# Altium project RamanPrototype.PrjPcb
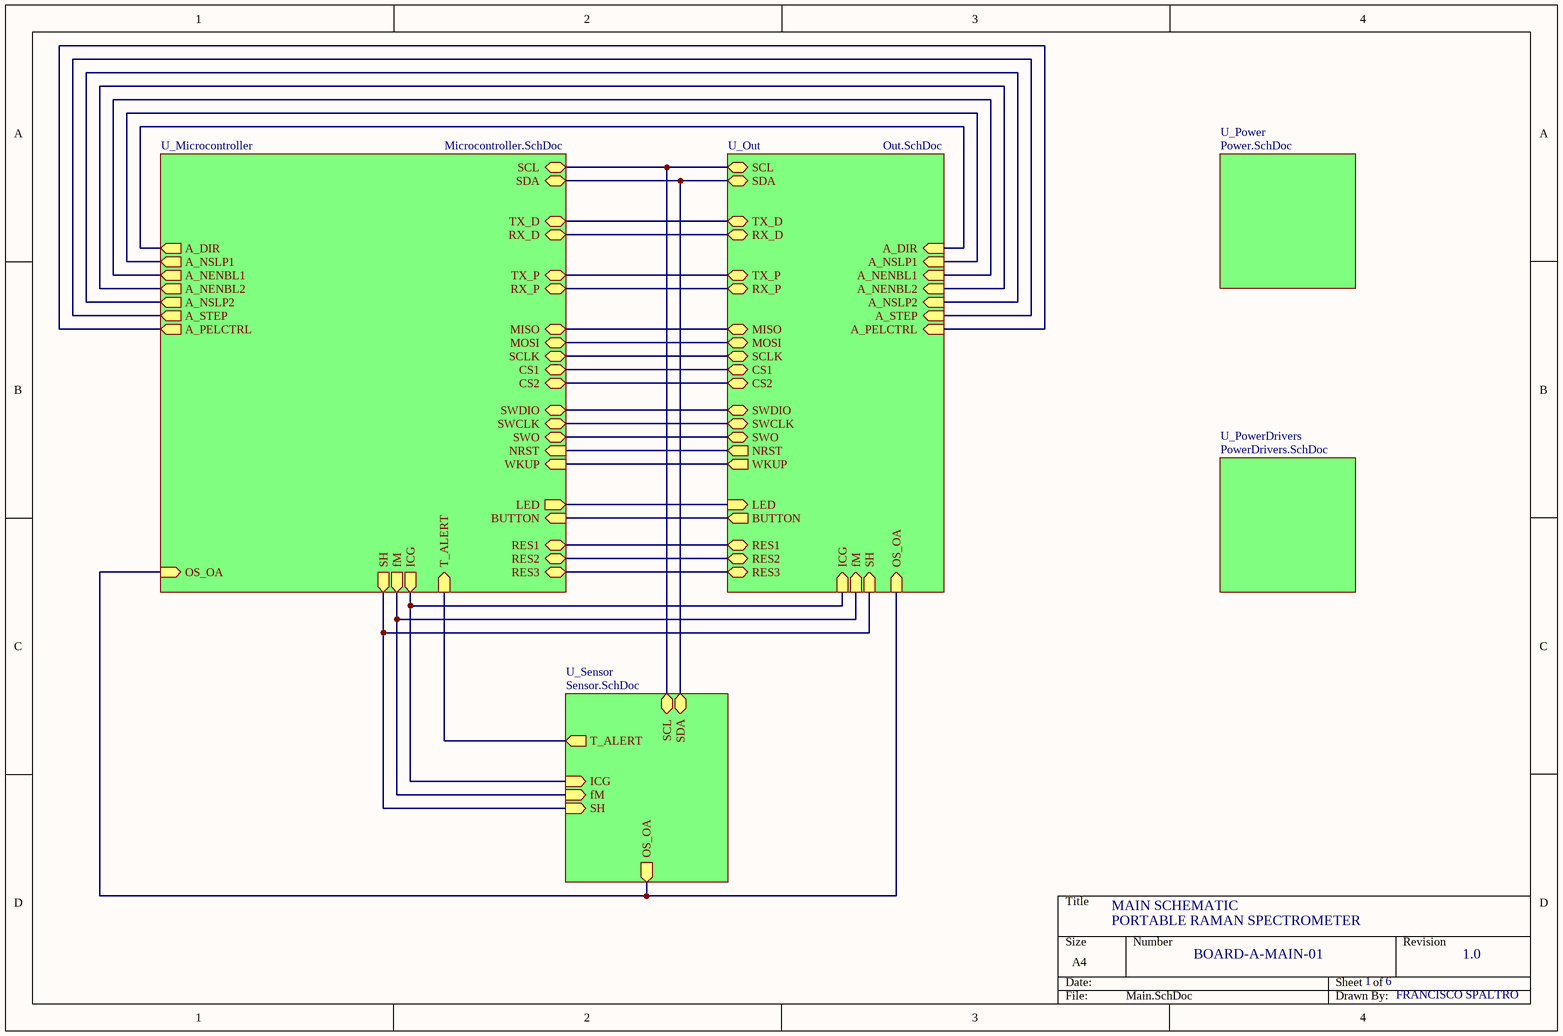
[diagram p0: Main.SchDoc]
6 sheets, 124 parts. Net scope: hierarchical (ports join the sheet entries above them; power ports are global).
Board files: PCB5.PcbDoc, PCB6.PcbDoc
Sheets:
  Main.SchDoc
    U_Out = Out.SchDoc
    U_Sensor = Sensor.SchDoc
    U_Power = Power.SchDoc
    U_PowerDrivers = PowerDrivers.SchDoc
    U_Microcontroller = Microcontroller.SchDoc

## Sheet Main.SchDoc
size A4; SheetNumber: 1; SheetTotal: 6

### Sub-sheets
U_Microcontroller = Microcontroller.SchDoc: SCL (bidir), TX_P (bidir), RX_P (bidir), SWDIO (bidir), SWCLK (bidir), TX_D (bidir), RX_D (bidir), SDA (bidir), SCLK (bidir), MISO (bidir), MOSI (bidir), SH (out), fM (out), ICG (out), LED (out), BUTTON (in), RES1 (bidir), RES2 (bidir), WKUP (in), CS1 (bidir), SWO (bidir), NRST (in), CS2 (bidir), T_ALERT (in), A_DIR (out), A_NSLP1 (out), A_NENBL1 (out), A_NENBL2 (out), A_NSLP2 (out), A_STEP (out), A_PELCTRL (out), RES3 (bidir), OS_OA (in)
U_Out = Out.SchDoc: TX_P (bidir), RX_P (bidir), TX_D (bidir), RX_D (bidir), MISO (bidir), MOSI (bidir), SCL (bidir), SDA (bidir), SCLK (bidir), SH (in), fM (in), ICG (in), SWDIO (bidir), SWCLK (bidir), RES1 (bidir), RES2 (bidir), LED (in), BUTTON (out), WKUP (out), CS1 (bidir), CS2 (bidir), NRST (out), SWO (bidir), A_DIR (in), A_NSLP1 (in), A_NENBL1 (in), A_STEP (in), A_NENBL2 (in), A_NSLP2 (in), A_PELCTRL (in), RES3 (bidir), OS_OA (in)
U_Power = Power.SchDoc: no entries
U_PowerDrivers = PowerDrivers.SchDoc: no entries
U_Sensor = Sensor.SchDoc: ICG (in), fM (in), SH (in), SCL (bidir), SDA (bidir), T_ALERT (out), OS_OA (out)

### Nets
NetB1_3: sheet U_Out/ICG, sheet U_Sensor/ICG, sheet U_Microcontroller/ICG
NetB1_4: sheet U_Out/fM, sheet U_Sensor/fM, sheet U_Microcontroller/fM
NetB1_5: sheet U_Out/SH, sheet U_Sensor/SH, sheet U_Microcontroller/SH
NetC14_1: sheet U_Out/NRST, sheet U_Microcontroller/NRST
NetC15_2: sheet U_Out/OS_OA, sheet U_Sensor/OS_OA, sheet U_Microcontroller/OS_OA
NetC32_1: sheet U_Out/BUTTON, sheet U_Microcontroller/BUTTON
NetJ5_01: sheet U_Out/RX_D, sheet U_Microcontroller/RX_D
NetJ5_02: sheet U_Out/TX_D, sheet U_Microcontroller/TX_D
NetJ6_01: sheet U_Out/SCL, sheet U_Sensor/SCL, sheet U_Microcontroller/SCL
NetJ6_02: sheet U_Out/SDA, sheet U_Sensor/SDA, sheet U_Microcontroller/SDA
NetJ7_02: sheet U_Out/MOSI, sheet U_Microcontroller/MOSI
NetJ7_03: sheet U_Out/MISO, sheet U_Microcontroller/MISO
NetJ7_04: sheet U_Out/SCLK, sheet U_Microcontroller/SCLK
NetJ7_05: sheet U_Out/CS1, sheet U_Microcontroller/CS1
NetJ7_06: sheet U_Out/CS2, sheet U_Microcontroller/CS2
NetJ8_02: sheet U_Out/SWO, sheet U_Microcontroller/SWO
NetJ8_03: sheet U_Out/SWCLK, sheet U_Microcontroller/SWCLK
NetJ8_05: sheet U_Out/SWDIO, sheet U_Microcontroller/SWDIO
NetJ9_02: sheet U_Out/RES3, sheet U_Microcontroller/RES3
NetJ9_03: sheet U_Out/RES2, sheet U_Microcontroller/RES2
NetJ9_04: sheet U_Out/RES1, sheet U_Microcontroller/RES1
NetJ9_05: sheet U_Out/WKUP, sheet U_Microcontroller/WKUP
NetJ11_1: sheet U_Out/A_PELCTRL, sheet U_Microcontroller/A_PELCTRL
NetJ11_2: sheet U_Out/A_STEP, sheet U_Microcontroller/A_STEP
NetJ11_3: sheet U_Out/A_NENBL1, sheet U_Microcontroller/A_NENBL1
NetJ11_4: sheet U_Out/A_NSLP1, sheet U_Microcontroller/A_NSLP1
NetJ11_5: sheet U_Out/A_DIR, sheet U_Microcontroller/A_DIR
NetJ11_6: sheet U_Out/A_NENBL2, sheet U_Microcontroller/A_NENBL2
NetJ11_7: sheet U_Out/A_NSLP2, sheet U_Microcontroller/A_NSLP2
NetR9_1: sheet U_Sensor/T_ALERT, sheet U_Microcontroller/T_ALERT
NetR13_1: sheet U_Out/LED, sheet U_Microcontroller/LED
NetR14_2: sheet U_Out/RX_P, sheet U_Microcontroller/RX_P
NetR15_1: sheet U_Out/TX_P, sheet U_Microcontroller/TX_P

### Notes on the sheet
- MAIN SCHEMATIC
- PORTABLE RAMAN SPECTROMETER
- BOARD-A-MAIN-01
- 1
- 6
- 1.0
- FRANCISCO SPALTRO

## Sheet Out.SchDoc
size A4; SheetNumber: 5; SheetTotal: 6
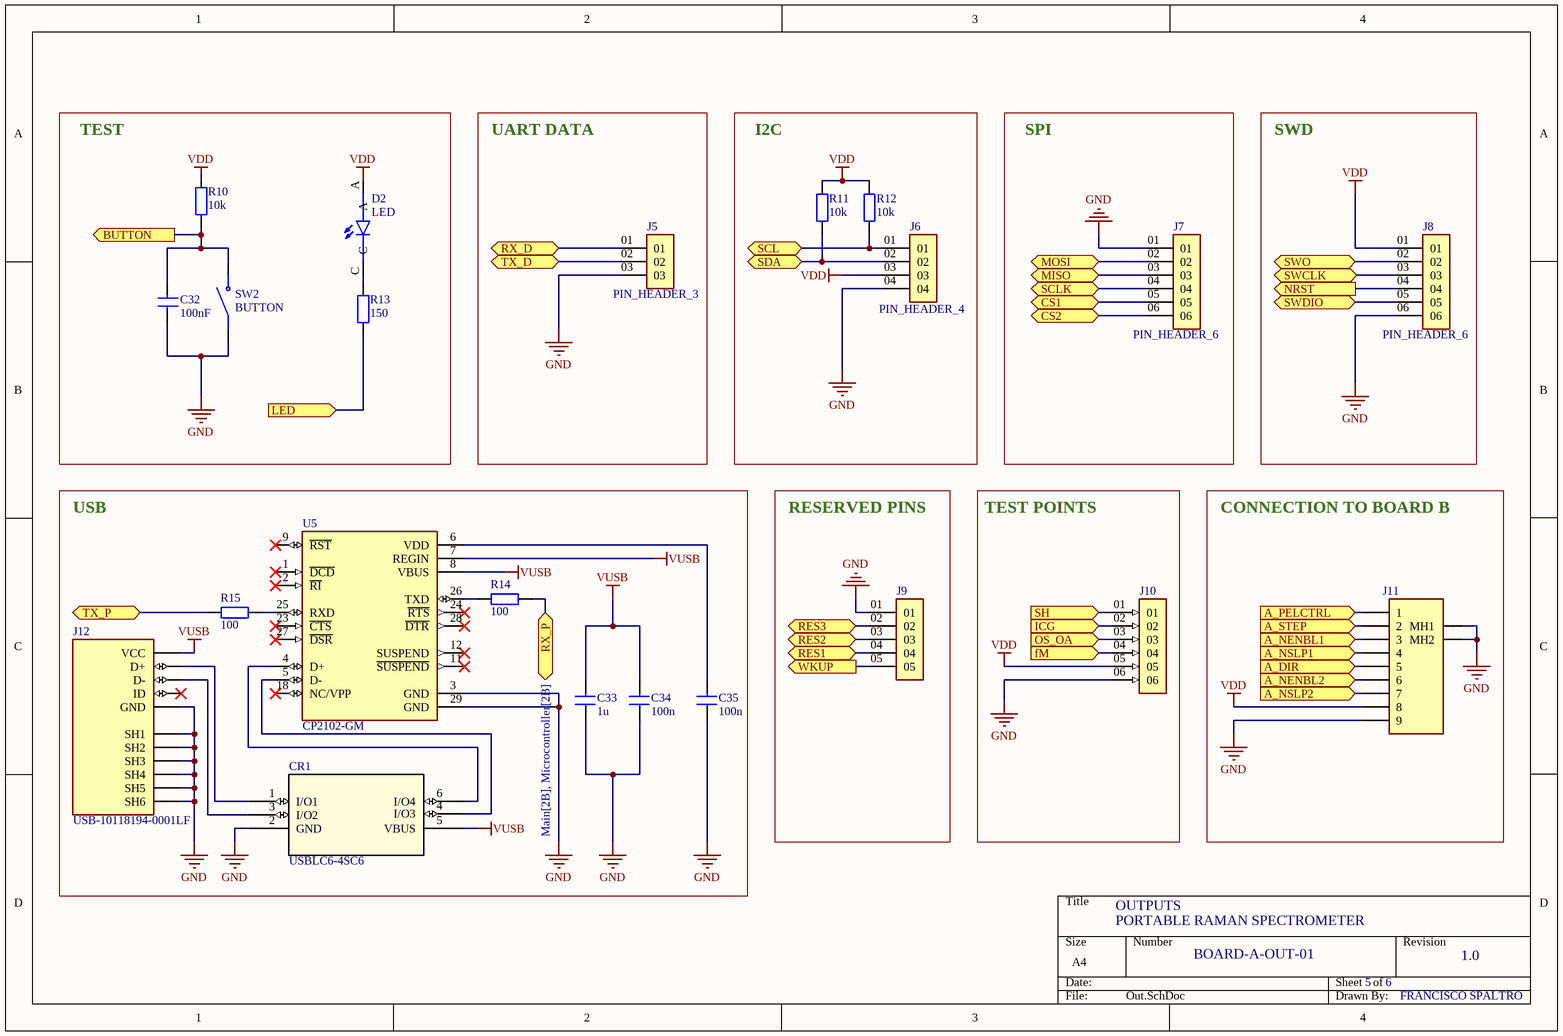
[diagram p1: Out.SchDoc]

### Parts
C32  100nF  [RES_0805]
C33  1u  [RES_0805]
C34  100n  [RES_0805]
C35  100n  [RES_0805]
CR1  USBLC6-4SC6  [SOT23-6L_STM-M]
D2  LED  [LEDC1608X35N]
J5  PIN_HEADER_3  [GEN_PIN3]
J6  PIN_HEADER_4  [GEN_PIN4]
J7  PIN_HEADER_6  [GEN_PIN6]
J8  PIN_HEADER_6  [GEN_PIN6]
J9  PIN_HEADER_5  [GEN_PIN5]  (value not drawn)
J10  PIN_HEADER_6  [GEN_PIN6]  (value not drawn)
J11  Phoenix9V_1821465  [PHOENIX_1821465]  (value not drawn)
J12  USB-10118194-0001LF  [AMPHENOL_10118194-0001LF]
R10  10k  [RES_0805]
R11  10k  [RES_0805]
R12  10k  [RES_0805]
R13  150  [RES_0805]
R14  100  [RES_0805]
R15  100  [RES_0805]
SW2  BUTTON  [SW_B3U-1000P]
U5  CP2102-GM  [QFN50P500X500X100-29N]

### Blocks framed on the sheet
TEST: C32 D2 R10 R13 SW2
UART DATA: J5
I2C: J6 R11 R12
SPI: J7
SWD: J8
USB: C33-C35 CR1 J12 R14 R15 U5
RESERVED PINS: J9
TEST POINTS: J10
CONNECTION TO BOARD B: J11

### Ports
A_DIR (in, see Main[3A], Microcontroller[3C]), A_NENBL1 (in, see Main[3B], Microcontroller[2C]), A_NENBL2 (in, see Main[3B], Microcontroller[3C]), A_NSLP1 (in, see Main[3B], Microcontroller[2C]), A_NSLP2 (in, see Main[3B], Microcontroller[3C]), A_PELCTRL (in, see Main[3B], Microcontroller[3B]), A_STEP (in, see Main[3B], Microcontroller[3B]), BUTTON (out, see Main[2C], Microcontroller[2C]), CS1 (bidir, see Main[2B], Microcontroller[3B]), CS2 (bidir, see Main[2B], Microcontroller[2B]), fM (in, see Main[3C], Microcontroller[2B], Sensor[2A]), ICG (in, see Main[3C], Microcontroller[2B], Sensor[2A]), LED (in, see Main[2B], Microcontroller[3B]), MISO (bidir, see Main[2B], Microcontroller[3B]), MOSI (bidir, see Main[2B], Microcontroller[3B]), NRST (out, see Main[2B], Microcontroller[2A]), OS_OA (in, see Main[3C], Microcontroller[1B], Sensor[4B]), RES1 (bidir, see Main[2C], Microcontroller[3B]), RES2 (bidir, see Main[2C], Microcontroller[2C]), RES3 (bidir, see Main[2C], Microcontroller[3B]), RX_D (bidir, see Main[2A], Microcontroller[3B]), RX_P (bidir, see Main[2B], Microcontroller[2B]), SCL (bidir, see Main[2A], Microcontroller[2B], Sensor[1C]), SCLK (bidir, see Main[2B], Microcontroller[3B]), SDA (bidir, see Main[2A], Microcontroller[3C], Sensor[1C]), SH (in, see Main[3C], Microcontroller[2B], Sensor[2A]), SWCLK (bidir, see Main[2B], Microcontroller[2B]), SWDIO (bidir, see Main[2B], Microcontroller[2B]), SWO (bidir, see Main[2B], Microcontroller[2C]), TX_D (bidir, see Main[2A], Microcontroller[3B]), TX_P (bidir, see Main[2B], Microcontroller[2B]), WKUP (out, see Main[2B], Microcontroller[2B])

### Nets
GND: C32.2 C33.1 C34.1 C35.1 CR1.2(GND) J5.03 J6.04 J7.01 J8.06 J9.01 J10.06 J11.9 J11.MH1 J11.MH2 J12.5(GND) J12.SH1 J12.SH2 J12.SH3 J12.SH4 J12.SH5 J12.SH6 SW2.1 U5.3(GND) U5.29(GND)
VDD: D2.A J6.03 J8.01 J10.05 J11.8 R10.2 R11.2 R12.2
VUSB: C33.2 C34.2 CR1.5(VBUS) J12.1(VCC) U5.7(REGIN) U5.8(VBUS)
NetB1_3: J10.02 ; port ICG
NetB1_4: J10.04 ; port fM
NetB1_5: J10.01 ; port SH
NetC14_1: J8.04 ; port NRST
NetC15_2: J10.03 ; port OS_OA
NetC32_1: C32.1 R10.1 SW2.2 ; port BUTTON
NetC35_2: C35.2 U5.6(VDD)
NetCR1_1: CR1.1(I/O1) J12.3(D+)
NetCR1_3: CR1.3(I/O2) J12.2(D-)
NetCR1_4: CR1.4(I/O3) U5.5(D-)
NetCR1_6: CR1.6(I/O4) U5.4(D+)
NetD2_C: D2.C R13.2
NetJ5_01: J5.01 ; port RX_D
NetJ5_02: J5.02 ; port TX_D
NetJ6_01: J6.01 R12.1 ; port SCL
NetJ6_02: J6.02 R11.1 ; port SDA
NetJ7_02: J7.02 ; port MOSI
NetJ7_03: J7.03 ; port MISO
NetJ7_04: J7.04 ; port SCLK
NetJ7_05: J7.05 ; port CS1
NetJ7_06: J7.06 ; port CS2
NetJ8_02: J8.02 ; port SWO
NetJ8_03: J8.03 ; port SWCLK
NetJ8_05: J8.05 ; port SWDIO
NetJ9_02: J9.02 ; port RES3
NetJ9_03: J9.03 ; port RES2
NetJ9_04: J9.04 ; port RES1
NetJ9_05: J9.05 ; port WKUP
NetJ11_1: J11.1 ; port A_PELCTRL
NetJ11_2: J11.2 ; port A_STEP
NetJ11_3: J11.3 ; port A_NENBL1
NetJ11_4: J11.4 ; port A_NSLP1
NetJ11_5: J11.5 ; port A_DIR
NetJ11_6: J11.6 ; port A_NENBL2
NetJ11_7: J11.7 ; port A_NSLP2
NetR13_1: R13.1 ; port LED
NetR14_1: R14.1 U5.26(TXD)
NetR14_2: R14.2 ; port RX_P
NetR15_1: R15.1 ; port TX_P
NetR15_2: R15.2 U5.25(RXD)

Not connected (* = marked no-connect by the designer): J12 4(ID)*; U5 1(~{DCD})* 2(~{RI})* 9(~{RST})* 11(~{SUSPEND})* 12(SUSPEND)* 18(NC/VPP)* 23(~{CTS})* 24(~{RTS})* 27(~{DSR})* 28(~{DTR})*

### Notes on the sheet
- OUTPUTS
- PORTABLE RAMAN SPECTROMETER
- BOARD-A-OUT-01
- 5
- 6
- 1.0
- FRANCISCO SPALTRO
- (in symbol CAP_0805) 0805

### Library data of the parts
C32-C35 = CAP_0805: Generic Capacitor
CR1 = USBLC6-4SC6: Very low capacitance ESD protection; Manufacturer_Name: STMicroelectronics; Copyright: Copyright (C) 2025 Ultra Librarian. All rights reserved.; Manufacturer_Part_Number: USBLC6-4SC6; RefDes: RefDes; Type: Type
D2 = LED-LTST-C190KRKT: Red 631nm LED Indication - Discrete 2V 0603 (1608 Metric); MF: Lite-On Inc.; Check_prices: https://www.snapeda.com/parts/LTST-C190KRKT/Lite-On+Inc./view-part/?ref=eda; Value: *; Purchase-URL: https://pricing.snapeda.com/search/part/LTST-C190KRKT/?ref=eda; Price: None; MP: LTST-C190KRKT; SnapEDA_Link: https://www.snapeda.com/parts/LTST-C190KRKT/Lite-On+Inc./view-part/?ref=snap; Availability: In Stock; Package: 0603 Lite-On
J5 = PIN_HEADER_3: Generic 40 mils drill size, 100 mils step; MF: Samtec Inc.; MP: TS-103-T-A; SnapEDA_Link: https://www.snapeda.com/parts/TS-103-T-A/Samtec+Inc./view-part/?ref=snap; Package: None; Value: *; Check_prices: https://www.snapeda.com/parts/TS-103-T-A/Samtec+Inc./view-part/?ref=eda
J6 = PIN_HEADER_4: Generic 40 mils drill size, 100 mils step; MF: Samtec Inc.; MP: TS-104-T-A; Check_prices: https://www.snapeda.com/parts/TS-104-T-A/Samtec+Inc./view-part/?ref=eda; Value: *; Availability: In Stock; Price: None; Package: None; SnapEDA_Link: https://www.snapeda.com/parts/TS-104-T-A/Samtec+Inc./view-part/?ref=snap; Purchase-URL: https://pricing.snapeda.com/search/part/TS-104-T-A/?ref=eda
J7 J8 J10 = PIN_HEADER_6: Generic 40 mils drill size, 100 mils step; MF: Samtec Inc.; MP: TS-106-T-A; SnapEDA_Link: https://www.snapeda.com/parts/TS-106-T-A/Samtec+Inc./view-part/?ref=snap; Package: None; Value: *; Check_prices: https://www.snapeda.com/parts/TS-106-T-A/Samtec+Inc./view-part/?ref=eda
J9 = PIN_HEADER_5: Generic 40 mils drill size, 100 mils step; MF: Samtec Inc.; MP: TS-105-T-A; Package: None; Check_prices: https://www.snapeda.com/parts/TS-105-T-A/Samtec+Inc./view-part/?ref=eda; Availability: In Stock; Value: *; Purchase-URL: https://pricing.snapeda.com/search/part/TS-105-T-A/?ref=eda; Price: None; SnapEDA_Link: https://www.snapeda.com/parts/TS-105-T-A/Samtec+Inc./view-part/?ref=snap
J11 = Phoenix9V_1821465: MF: {'manufacturer': u'Phoenix Contact'}; Package: None; Price: None; Value: *; MP: 1821465; Availability: Unavailable
J12 = USB-10118194-0001LF: Micro USB, Input Output Connectors, B TYPE RECEPTACLE with flange; MF: Amphenol ICC; SnapEDA_Link: https://www.snapeda.com/parts/10118194-0001LF/Amphenol+FCI/view-part/?ref=snap; Package: None; Value: *; MP: 10118194-0001LF; Check_prices: https://www.snapeda.com/parts/10118194-0001LF/Amphenol+FCI/view-part/?ref=eda
R10-R15 = RES_0805: Generic Capacitor
SW2 = SW-B3U-1000P: Switch Tactile N.O. SPST Round Button Gull Wing 0.05A 12VDC 1.5N SMD Embossed T/R; Price: None; MP: B3U-1000P; Availability: Unavailable; Value: *; Package: None
U5 = CP2102-GM: USB Bridge, USB to UART USB 2.0 UART Interface 28-QFN (5x5); MF: Silicon Labs; SnapEDA_Link: https://www.snapeda.com/parts/CP2102-GM/Silicon+Labs/view-part/?ref=snap; Package: QFN-28 Silicon Labs; Value: *; MP: CP2102-GM; Check_prices: https://www.snapeda.com/parts/CP2102-GM/Silicon+Labs/view-part/?ref=eda

## Sheet Sensor.SchDoc
size A4; SheetNumber: 4; SheetTotal: 6
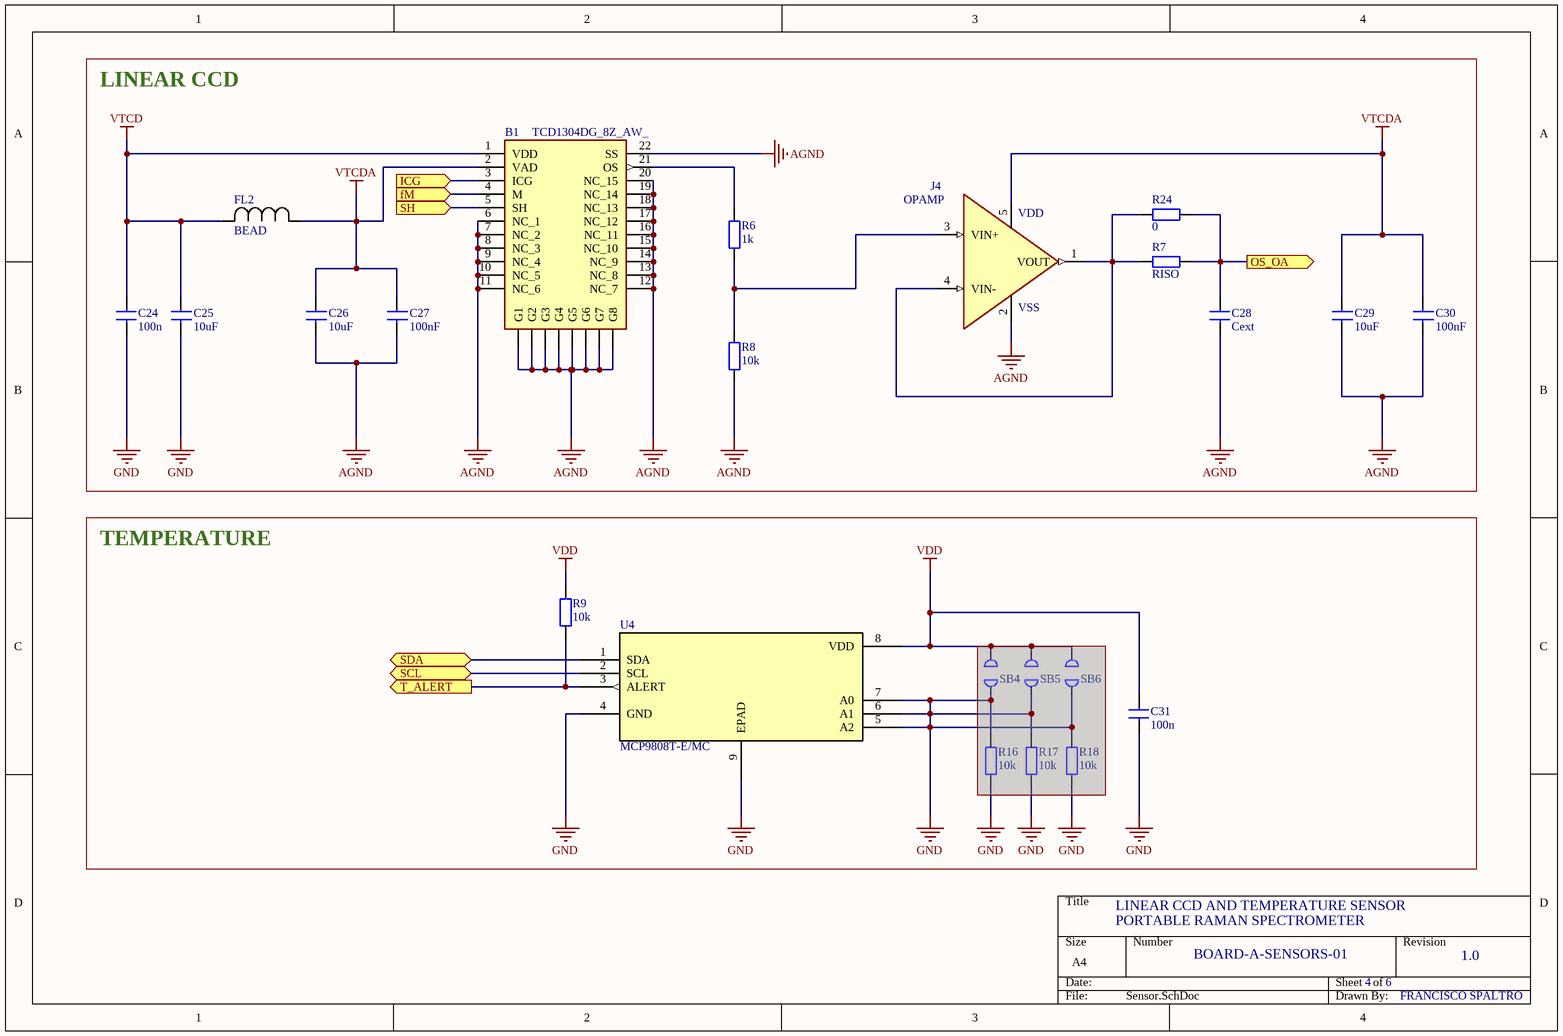
[diagram p2: Sensor.SchDoc]

### Parts
(Parts that share a designator on the sheet are numbered #1, #2 ... from top to bottom, then left to right.)
B1  TCD1304DG_8Z_AW_  [SOCKET-15_SMD-HARWIN_M20-7861546]
C24  100n  [RES_0805]
C25  10uF  [RES_0805]
C26  10uF  [RES_0805]
C27  100nF  [RES_0805]
C28  Cext  [RES_0805]
C29  10uF  [RES_0805]
C30  100nF  [RES_0805]
C31  100n  [RES_0805]
FL2  BEAD  [IND_1608_TDK-M]
J4  OPAMP  [SOT95P280X145-5N]
R6  1k  [RES_0805]
R7  RISO  [RES_0805]
R8  10k  [RES_0805]
R9  10k  [RES_0805]
R16#1  10k  [RES_0805]  (masked out: inside a compile mask, not in the netlist)
R17#1  10k  [RES_0805]  (masked out: inside a compile mask, not in the netlist)
R18#1  10k  [RES_0805]  (masked out: inside a compile mask, not in the netlist)
R24  0  [RES_0805]
SB4  SolderBridge_Open  [SolderBridge_Open]  (value not drawn)  (masked out: inside a compile mask, not in the netlist)
SB5  SolderBridge_Open  [SolderBridge_Open]  (value not drawn)  (masked out: inside a compile mask, not in the netlist)
SB6  SolderBridge_Open  [SolderBridge_Open]  (value not drawn)  (masked out: inside a compile mask, not in the netlist)
U4  MCP9808T-E/MC  [DFN8_2x3MC_MCH-M]

### Blocks framed on the sheet
LINEAR CCD: B1 C24-C30 FL2 J4 R6-R8 R24
TEMPERATURE: C31 R9 R16#1 R17#1 R18#1 SB4-SB6 U4

### Ports
fM (in, see Main[2D], Microcontroller[2B], Out[3C]), ICG (in, see Main[2D], Microcontroller[2B], Out[3C]), OS_OA (out, see Main[2D], Microcontroller[1B], Out[3C]), SCL (bidir, see Main[2C], Microcontroller[2B], Out[2A]), SDA (bidir, see Main[2C], Microcontroller[3C], Out[2B]), SH (in, see Main[2D], Microcontroller[2B], Out[3C]), T_ALERT (out, see Main[2C], Microcontroller[3B])

### Nets
AGND: B1.6(NC_1) B1.7(NC_2) B1.8(NC_3) B1.9(NC_4) B1.10(NC_5) B1.11(NC_6) B1.12(NC_7) B1.13(NC_8) B1.14(NC_9) B1.15(NC_10) B1.16(NC_11) B1.17(NC_12) B1.18(NC_13) B1.19(NC_14) B1.20(NC_15) B1.22(SS) B1.G1 B1.G2 B1.G3 B1.G4 B1.G5 B1.G6 B1.G7 B1.G8 C26.2 C27.2 C28.1 C29.2 C30.2 J4.2(VSS) R8.2
GND: C24.1 C25.2 C31.1 U4.4(GND) U4.5(A2) U4.6(A1) U4.7(A0) U4.9(EPAD)
VDD: C31.2 R9.2 U4.8(VDD)
VTCD: B1.1(VDD) C24.2 C25.1 FL2.2
VTCDA: B1.2(VAD) C26.1 C27.1 C29.1 C30.1 FL2.1 J4.5(VDD)
NetB1_3: B1.3(ICG) ; port ICG
NetB1_4: B1.4(M) ; port fM
NetB1_5: B1.5(SH) ; port SH
NetB1_21: B1.21(OS) R6.1
NetC15_2: C28.2 R7.2 R24.2 ; port OS_OA
NetJ4_1: J4.1(VOUT) J4.4(VIN-) R7.1 R24.1
NetJ4_3: J4.3(VIN+) R6.2 R8.1
NetJ6_01: U4.2(SCL) ; port SCL
NetJ6_02: U4.1(SDA) ; port SDA
NetR9_1: R9.1 U4.3(ALERT) ; port T_ALERT

### Notes on the sheet
- LINEAR CCD AND TEMPERATURE SENSOR
- PORTABLE RAMAN SPECTROMETER
- BOARD-A-SENSORS-01
- 4
- 6
- 1.0
- FRANCISCO SPALTRO
- (in symbol CAP_0805) 0805

### Library data of the parts
B1 = TCD1304DG_8Z_AW_: Image Sensors & Color Sensors CCD Linear Sensor 3648 8x20 54mm; Manufacturer_Name: Toshiba; Manufacturer_Part_Number: TCD1304DG(8Z,AW); Geometry.Height: 3.72mm; Mouser Part Number: 757-TCD1304DG8ZAW; Mouser Price/Stock: https://www.mouser.co.uk/ProductDetail/Toshiba/TCD1304DG8ZAW?qs=OLJpxlzHOSRVMcyirxbASw%3D%3D; Datasheet Link: https://datasheet.datasheetarchive.com/originals/distributors/DKDS-29/569259.pdf
C24-C31 = CAP_0805: Generic Capacitor
FL2 = MMZ1608B601CTAH0: INDUCTOR; SMT (0603); FERRITE-BEAD; 600; TOL=+/-25%; 0.5A; -55 DEGC TO +125 DEGC; Manufacturer_Name: TDK; Copyright: Copyright (C) 2025 Ultra Librarian. All rights reserved.; Manufacturer_Part_Number: MMZ1608B601CTAH0
J4 = OPAMP-MCP6001UT-E/OT: Microchip MCP6001UT-E/OT Op Amp, 1MHz Rail-Rail, 1.8 - 6 V, 5-Pin SOT-23 | Microchip Technology Inc. MCP6001UT-E/OT; SnapEDA_Link: https://www.snapeda.com/parts/MCP6001UT-E/OT/Microchip/view-part/?ref=snap; Package: SOT-23 Microchip; Value: *; MF: Microchip; MP: MCP6001UT-E/OT; Check_prices: https://www.snapeda.com/parts/MCP6001UT-E/OT/Microchip/view-part/?ref=eda
R6-R9 R16#1 R17#1 R18#1 R24 = RES_0805: Generic Capacitor
U4 = MCP9808T-EMC: Description; Manufacturer_Name: Microchip; Copyright: Copyright (C) 2026 Ultra Librarian. All rights reserved.; Manufacturer_Part_Number: MCP9808T-E/MC; RefDes: RefDes; Type: Type

## Sheet Power.SchDoc
size A4; SheetNumber: 2; SheetTotal: 6
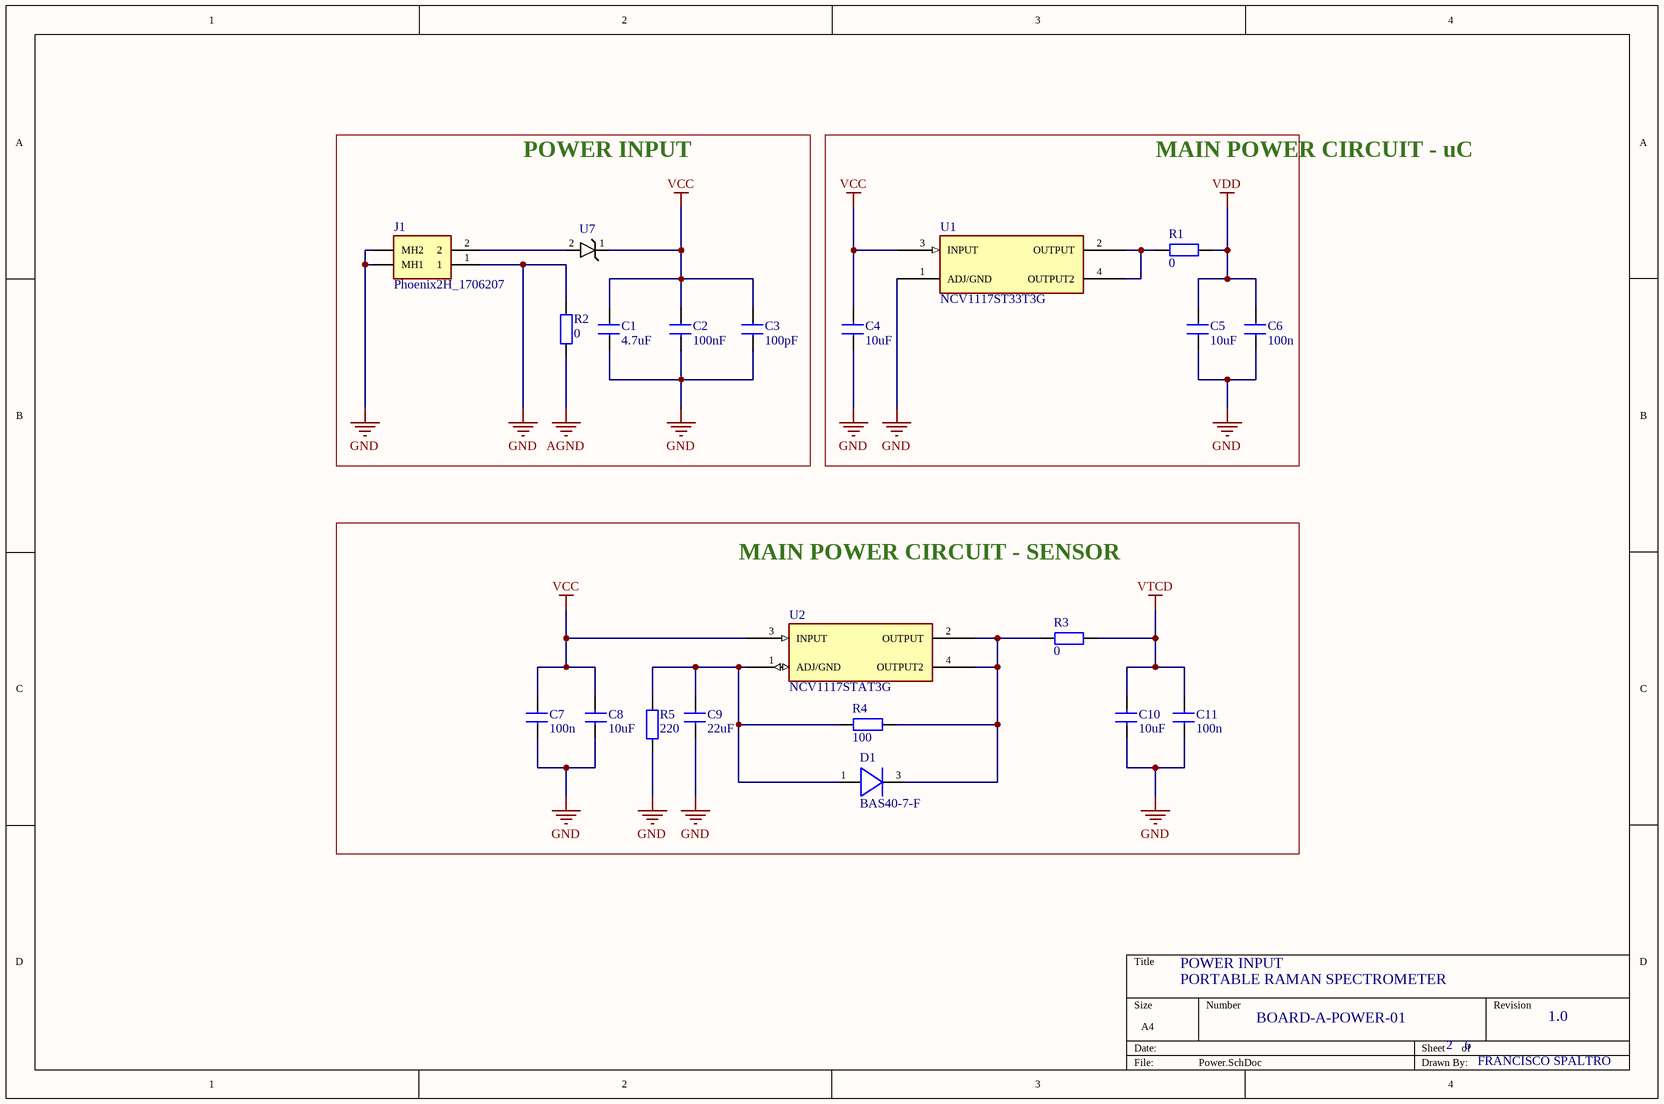
[diagram p3: Power.SchDoc]

### Parts
C1  4.7uF  [RES_0805]
C2  100nF  [RES_0805]
C3  100pF  [RES_0805]
C4  10uF  [RES_0805]
C5  10uF  [RES_0805]
C6  100n  [RES_0805]
C7  100n  [RES_0805]
C8  10uF  [RES_0805]
C9  22uF  [RES_0805]
C10  10uF  [RES_0805]
C11  100n  [RES_0805]
D1  BAS40-7-F  [SOT-23_DIO-M]
J1  Phoenix2H_1706207  [PHOENIX_1706207]
R1  0  [RES_0805]
R2  0  [RES_0805]
R3  0  [RES_0805]
R4  100  [RES_0805]
R5  220  [RES_0805]
U1  NCV1117ST33T3G  [SOT230P700X180-4N]
U2  NCV1117STAT3G  [SOT223-3_ONS-M]
U7  MBRA340T3G  [SMA_ONS]  (value not drawn)

### Blocks framed on the sheet
POWER INPUT: C1-C3 J1 R2 U7
MAIN POWER CIRCUIT - uC: C4-C6 R1 U1
MAIN POWER CIRCUIT - SENSOR: C7-C11 D1 R3-R5 U2

### Nets
AGND: R2.1
GND: C1.1 C2.1 C3.1 C4.1 C5.1 C6.1 C7.1 C8.1 C9.1 C10.1 C11.1 J1.1 J1.MH1 J1.MH2 R2.2 R5.1 U1.1(ADJ/GND)
VCC: C1.2 C2.2 C3.2 C4.2 C7.2 C8.2 U1.3(INPUT) U2.3(INPUT) U7.1(CATHODE)
VDD: C5.2 C6.2 R1.2
VTCD: C10.2 C11.2 R3.2
NetC9_2: C9.2 D1.1(A) R4.2 R5.2 U2.1(ADJ/GND)
NetD1_3: D1.3(C) R3.1 R4.1 U2.2(OUTPUT) U2.4(OUTPUT2)
NetJ1_2: J1.2 U7.2(ANODE)
NetR1_1: R1.1 U1.2(OUTPUT) U1.4(OUTPUT2)

### Notes on the sheet
- POWER INPUT
- PORTABLE RAMAN SPECTROMETER
- BOARD-A-POWER-01
- 2
- 6
- 1.0
- FRANCISCO SPALTRO
- (in symbol CAP_0805) 0805

### Library data of the parts
C1-C11 = CAP_0805: Generic Capacitor
D1 = DIODE-BAS40-7-F: Description; Manufacturer_Name: Diodes Inc; Type: Diodes - Rectifiers, Single; Copyright: Copyright (C) 2025 Ultra Librarian. All rights reserved.; Manufacturer_Part_Number: BAS40-7-F; RefDes: RefDes
R1-R5 = RES_0805: Generic Capacitor
U1 = REG3_3-NCV1117ST33T3G: Linear Voltage Regulator IC Positive Fixed 1 Output 1A SOT-223; MF: ON Semiconductor; SnapEDA_Link: https://www.snapeda.com/parts/NCV1117ST33T3G/Onsemi/view-part/?ref=snap; Package: SOT-223-4 ON Semiconductor; Value: *; MP: NCV1117ST33T3G; Check_prices: https://www.snapeda.com/parts/NCV1117ST33T3G/Onsemi/view-part/?ref=eda
U2 = NCV1117STAT3G: Description; Manufacturer_Name: onsemi; Copyright: Copyright (C) 2025 Ultra Librarian. All rights reserved.; Manufacturer_Part_Number: NCV1117STAT3G; RefDes: RefDes; Type: Type
U7 = MBRA340T3G: Description; Manufacturer_Name: onsemi; Copyright: Copyright (C) 2025 Ultra Librarian. All rights reserved.; Manufacturer_Part_Number: MBRA340T3G; RefDes: RefDes; Type: Type
J1 = Phoenix2H_1706207: Package: None; Price: None; Value: *; MP: 1706207; Availability: Unavailable

## Sheet PowerDrivers.SchDoc
size A4; SheetNumber: 6; SheetTotal: 6
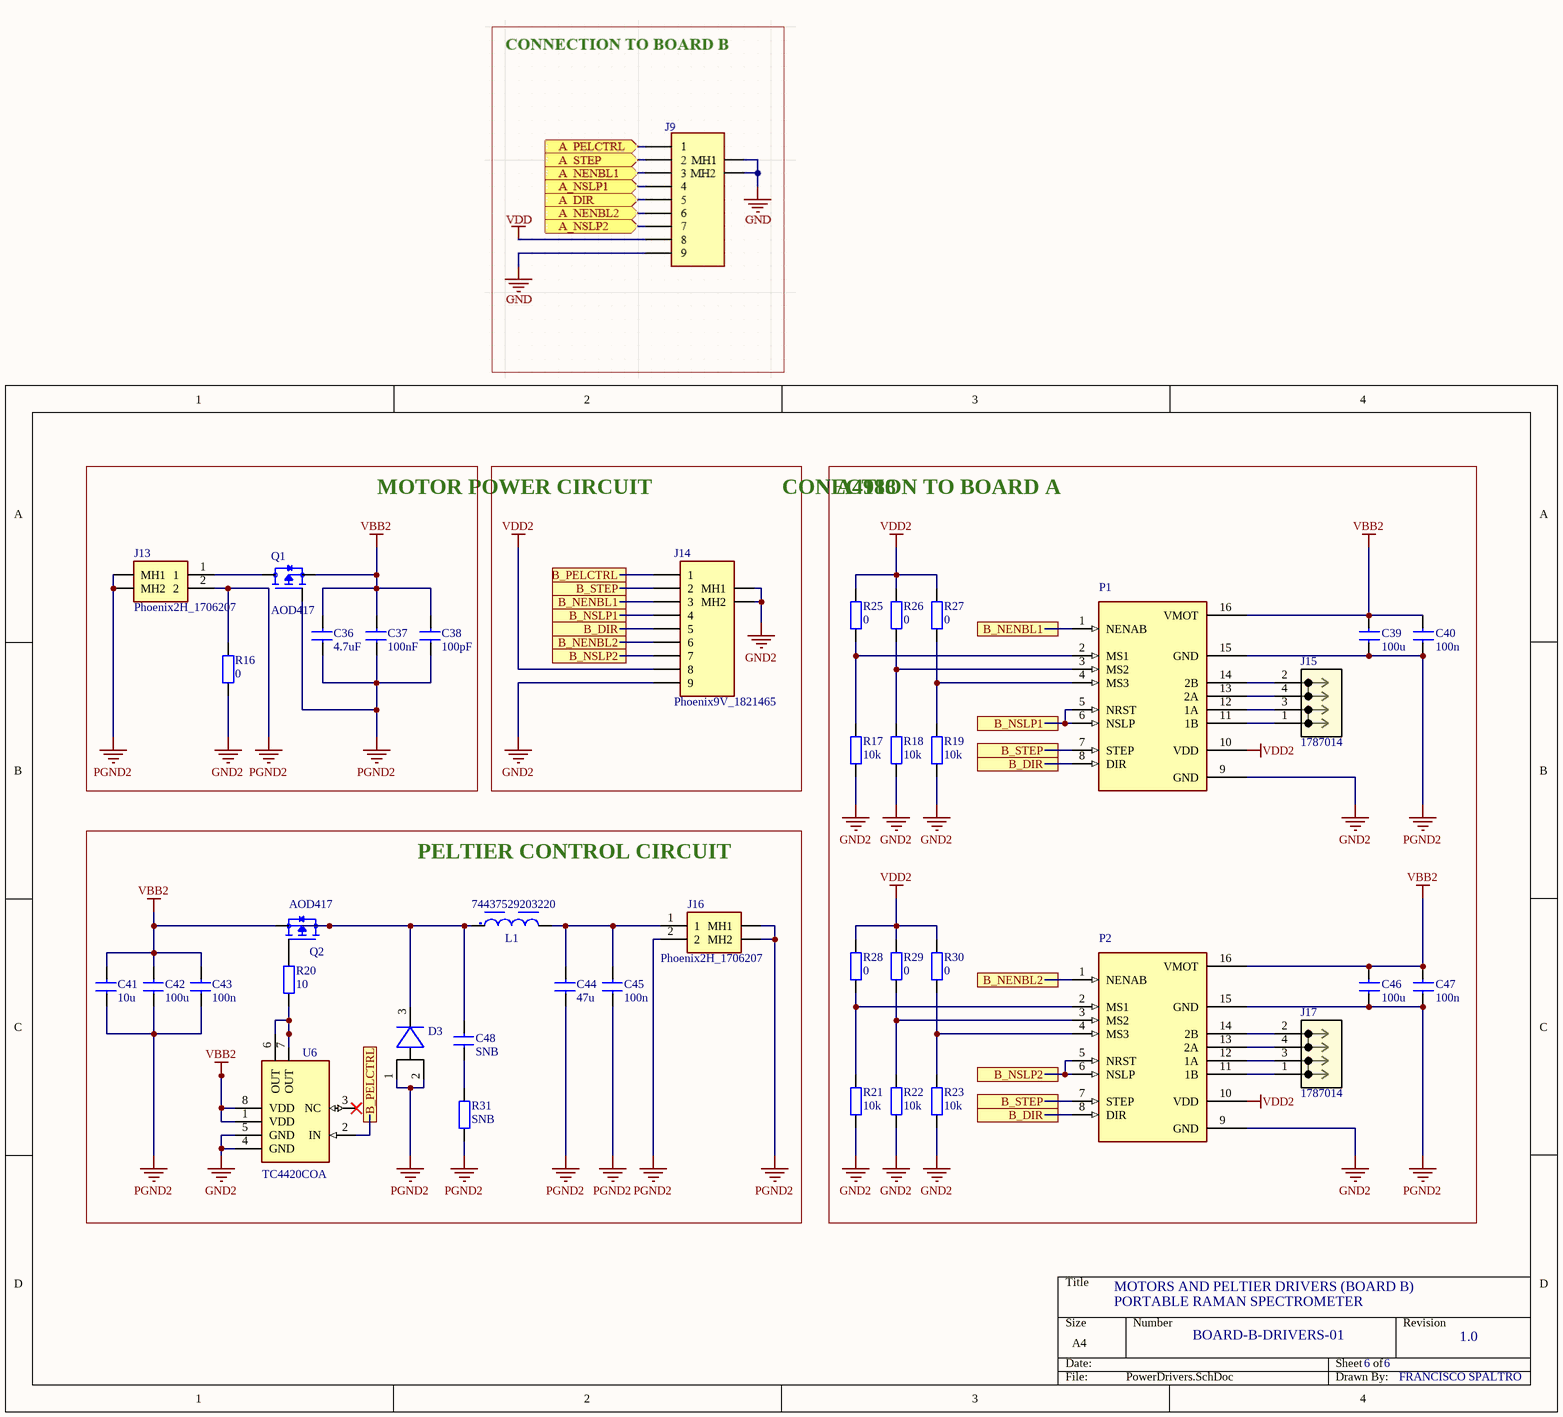
[diagram p4: PowerDrivers.SchDoc]

### Parts
(Parts that share a designator on the sheet are numbered #1, #2 ... from top to bottom, then left to right.)
C36  4.7uF  [RES_0805]
C37  100nF  [RES_0805]
C38  100pF  [RES_0805]
C39  100u  [RES_0805]
C40  100n  [RES_0805]
C41  10u  [RES_0805]
C42  100u  [RES_0805]
C43  100n  [RES_0805]
C44  47u  [RES_0805]
C45  100n  [RES_0805]
C46  100u  [RES_0805]
C47  100n  [RES_0805]
C48  SNB  [RES_0805]
D3  DIODE_FSV15150V  [FSV15150V_TO-277]  (value not drawn)
J13  Phoenix2H_1706207  [PHOENIX_1706207]
J14  Phoenix9V_1821465  [PHOENIX_1821465]
J15  1787014  [CONN4_1787014_PXC]
J16  Phoenix2H_1706207  [PHOENIX_1706207]
J17  1787014  [CONN4_1787014_PXC]
L1  74437529203220  [WE-HCF_2920_ROUND]
P1  2x8_PINES  [PINES8x2-sep]  (value not drawn)
P2  2x8_PINES  [PINES8x2-sep]  (value not drawn)
Q1  AOD417  [DPAK228P994X240_3N]
Q2  AOD417  [DPAK228P994X240_3N]
R16#2  0  [RES_0805]
R17#2  10k  [RES_0805]
R18#2  10k  [RES_0805]
R19  10k  [RES_0805]
R20  10  [RES_0805]
R21  10k  [RES_0805]
R22  10k  [RES_0805]
R23  10k  [RES_0805]
R25  0  [RES_0805]
R26  0  [RES_0805]
R27  0  [RES_0805]
R28  0  [RES_0805]
R29  0  [RES_0805]
R30  0  [RES_0805]
R31  SNB  [RES_0805]
U6  TC4420COA  [SOIC127P599X175-8N]

### Blocks framed on the sheet
MOTOR POWER CIRCUIT: C36-C38 J13 Q1 R16#2
CONECTION TO BOARD A: J14
A4988: C39 C40 C46 C47 J15 J17 P1 P2 R17#2 R18#2 R19 R21-R23 R25-R30
PELTIER CONTROL CIRCUIT: C41-C45 C48 D3 J16 L1 Q2 R20 R31 U6

### Nets
GND2: J14.9 J14.MH1 J14.MH2 P1.9(GND) P2.9(GND) R16#2.1 R17#2.1 R18#2.1 R19.1 R21.1 R22.1 R23.1 U6.4(GND) U6.5(GND)
PGND2: C36.1 C37.1 C38.1 C39.2 C40.2 C41.1 C42.1 C43.1 C44.1 C45.1 C46.2 C47.2 D3.1(A) D3.2 J13.2 J13.MH1 J13.MH2 J16.2 J16.MH1 J16.MH2 P1.15(GND) P2.15(GND) Q1.1(G) R16#2.2 R31.1
VBB2: C36.2 C37.2 C38.2 C39.1 C40.1 C41.2 C42.2 C43.2 C46.1 C47.1 P1.16(VMOT) P2.16(VMOT) Q1.3(S) Q2.3(S) U6.1(VDD) U6.8(VDD)
VDD2: J14.8 P1.10(VDD) P2.10(VDD) R25.2 R26.2 R27.2 R28.2 R29.2 R30.2
B_DIR: J14.5 P1.8(DIR) P2.8(DIR)
B_NENBL1: J14.3 P1.1(NENAB)
B_NENBL2: J14.6 P2.1(NENAB)
B_NSLP1: J14.4 P1.5(NRST) P1.6(NSLP)
B_NSLP2: J14.7 P2.5(NRST) P2.6(NSLP)
B_PELCTRL: J14.1 U6.2(IN)
B_STEP: J14.2 P1.7(STEP) P2.7(STEP)
NetC44_2: C44.2 C45.2 J16.1 L1.2
NetC48_1: C48.1 R31.2
NetC48_2: C48.2 D3.3(C) L1.1 Q2.4(D)
NetJ13_1: J13.1 Q1.4(D)
NetJ15_1: J15.1 P1.11(1B)
NetJ15_2: J15.2 P1.14(2B)
NetJ15_3: J15.3 P1.12(1A)
NetJ15_4: J15.4 P1.13(2A)
NetJ17_1: J17.1 P2.11(1B)
NetJ17_2: J17.2 P2.14(2B)
NetJ17_3: J17.3 P2.12(1A)
NetJ17_4: J17.4 P2.13(2A)
NetP1_2: P1.2(MS1) R17#2.2 R25.1
NetP1_3: P1.3(MS2) R18#2.2 R26.1
NetP1_4: P1.4(MS3) R19.2 R27.1
NetP2_2: P2.2(MS1) R21.2 R28.1
NetP2_3: P2.3(MS2) R22.2 R29.1
NetP2_4: P2.4(MS3) R23.2 R30.1
NetQ2_1: Q2.1(G) R20.2
NetR20_1: R20.1 U6.6(OUT) U6.7(OUT)

Not connected (* = marked no-connect by the designer): U6 3(NC)*

### Notes on the sheet
- MOTORS AND PELTIER DRIVERS (BOARD B)
- PORTABLE RAMAN SPECTROMETER
- BOARD-B-DRIVERS-01
- 6
- 1.0
- FRANCISCO SPALTRO

### Library data of the parts
C36-C48 = CAP_0805: Generic Capacitor
J14 = Phoenix9V_1821465: MF: {'manufacturer': u'Phoenix Contact'}; Package: None; Price: None; Value: *; MP: 1821465; Availability: Unavailable
J15 J17 = Phoenix_1787014_4P: PCB headers, nominal cross section: 1.5 mmÂ², color: black, nominal current: 8 A, rated voltage (III/2): 160 V, contact surface: Tin, contact connection type: Pin, number of potentials: 4, number of rows: 2, number of positions: 2, number of connections: 4, product range: DMC 1,5/..-G1F-THR, pitch: 3.5 mm, mounting: THR soldering, pin layout: Linear pinning, solder pin [P]: 2 mm, number of solder pins per potential: 1, plug-in system: COMBICON DFMC 1,5, Pin connector pattern alignment: Standard, locking: Snap-in locking, mounting: Lock &amp; release threaded flange, type of packaging: packed in cardboard; Manufacturer_Name: Phoenix Contact; Type: Headers, Plugs and Sockets; Copyright: Copyright (C) 2025 Ultra Librarian. All rights reserved.; Manufacturer_Part_Number: 1787014; RefDes: RefDes
L1 = 22uH_74437529203220: MF: {'manufacturer': u'W\xfcrth Elektronik'}; Package: None; Price: None; Value: *; MP: 74437529203220; Availability: Unavailable
Q1 Q2 = AOD417: P-Channel 30V 25A _Ta_ 2.5W _Ta_, 50W _Tc_ Surface Mount TO-252, _D-Pak_; MF: Alpha &; SnapEDA_Link: https://www.snapeda.com/parts/AOD417/Alpha%20%26%20Omega%20Semiconductor%20Inc./view-part/454934/?ref=snap; Availability: Unavailable; MP: AOD417; Price: None; Package: TO-252 Alpha &amp; Omega Semiconductor; Value: *
R16#2 R17#2 R18#2 R19-R23 R25-R31 = RES_0805: Generic Capacitor
U6 = TC4420COA: Microchip TC4420COA,MOSFET Power Driver 6A,4.5 to 18V,Non-Inverting,8-Pin SOIC | Microchip Technology Inc. TC4420COA; SnapEDA_Link: https://www.snapeda.com/parts/TC4420COA/Microchip/view-part/?ref=snap; Package: SOIC-8 Microchip; Value: *; MF: Microchip Technology; MP: TC4420COA; Check_prices: https://www.snapeda.com/parts/TC4420COA/Microchip/view-part/?ref=eda
J13 J16 = Phoenix2H_1706207: Package: None; Price: None; Value: *; MP: 1706207; Availability: Unavailable

## Sheet Microcontroller.SchDoc
size A4; SheetNumber: 3; SheetTotal: 6
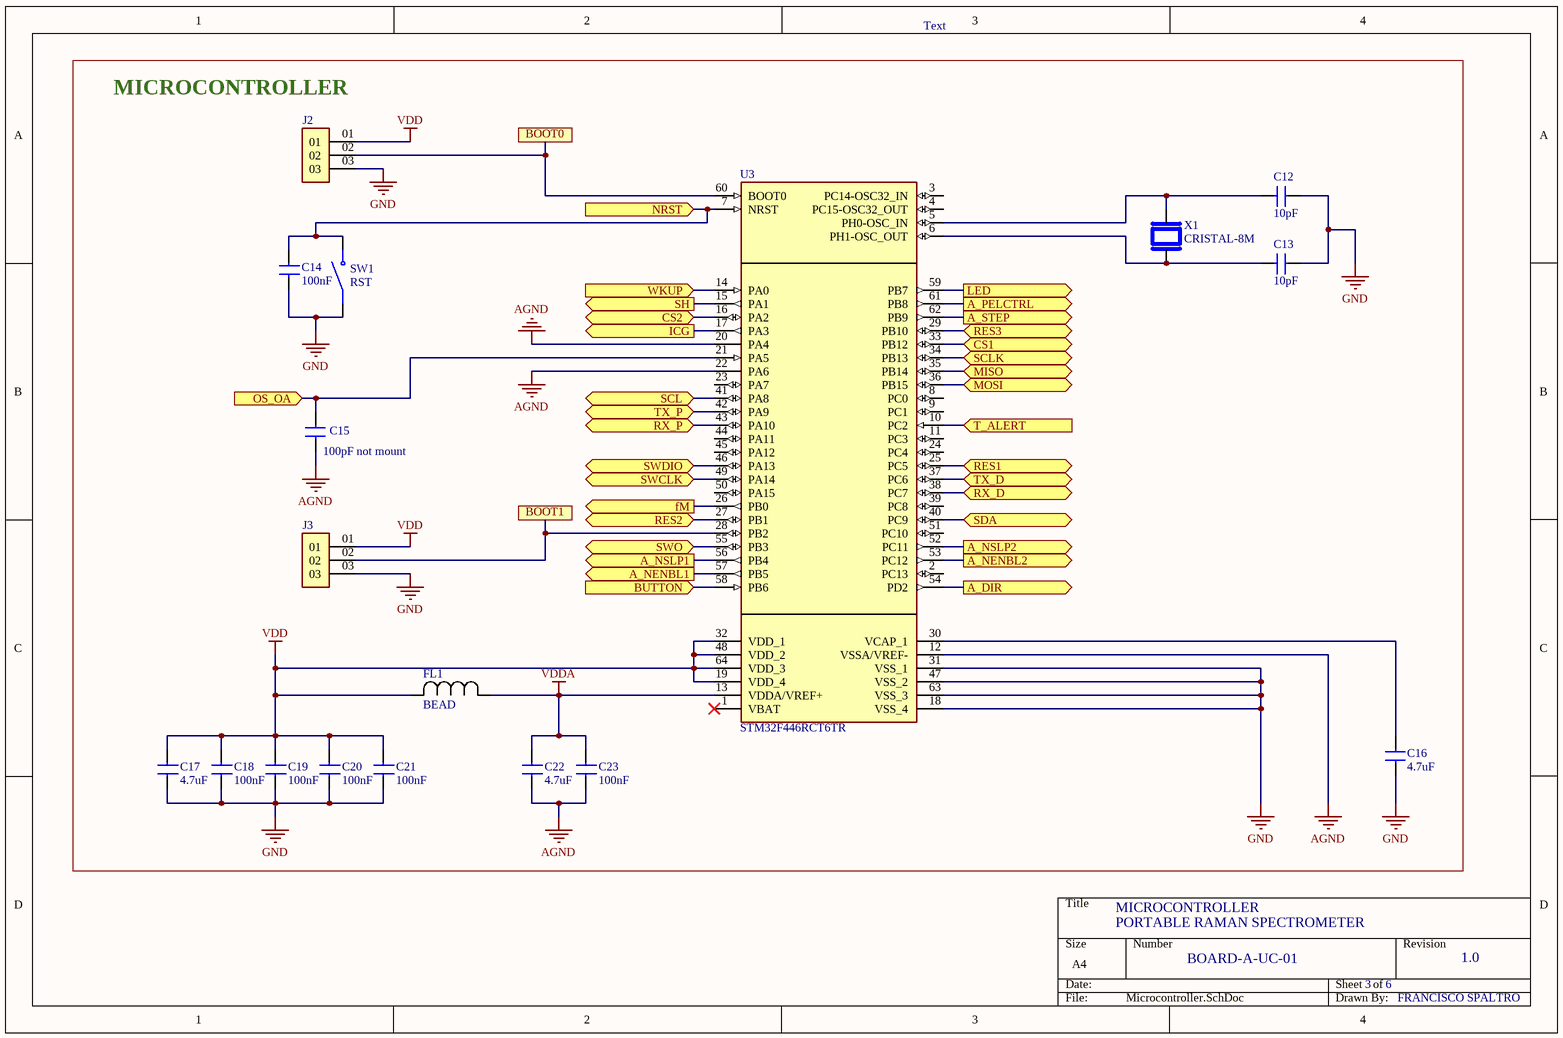
[diagram p5: Microcontroller.SchDoc]

### Parts
C12  10pF  [RES_0805]
C13  10pF  [RES_0805]
C14  100nF  [RES_0805]
C15  100pF not mount  [RES_0805]
C16  4.7uF  [RES_0805]
C17  4.7uF  [RES_0805]
C18  100nF  [RES_0805]
C19  100nF  [RES_0805]
C20  100nF  [RES_0805]
C21  100nF  [RES_0805]
C22  4.7uF  [RES_0805]
C23  100nF  [RES_0805]
FL1  BEAD  [IND_1608_TDK-M]
J2  PIN_HEADER_3  [GEN_PIN3]  (value not drawn)
J3  PIN_HEADER_3  [GEN_PIN3]  (value not drawn)
SW1  RST  [SW_B3U-1000P]
U3  STM32F446RCT6TR  [QFP50P1200X1200X160-64N]
X1  CRISTAL-8M  [XTALDFN320X250X100-2N]

### Blocks framed on the sheet
MICROCONTROLLER: C12-C23 FL1 J2 J3 SW1 U3 X1

### Ports
A_DIR (out, see Main[1A], Out[4C]), A_NENBL1 (out, see Main[1B], Out[4C]), A_NENBL2 (out, see Main[1B], Out[4C]), A_NSLP1 (out, see Main[1B], Out[4C]), A_NSLP2 (out, see Main[1B], Out[4C]), A_PELCTRL (out, see Main[1B], Out[4C]), A_STEP (out, see Main[1B], Out[4C]), BUTTON (in, see Main[2C], Out[1A]), CS1 (bidir, see Main[2B], Out[3B]), CS2 (bidir, see Main[2B], Out[3B]), fM (out, see Main[2C], Out[3C], Sensor[2A]), ICG (out, see Main[2C], Out[3C], Sensor[2A]), LED (out, see Main[2B], Out[1B]), MISO (bidir, see Main[2B], Out[3B]), MOSI (bidir, see Main[2B], Out[3B]), NRST (in, see Main[2B], Out[4B]), OS_OA (in, see Main[1C], Out[3C], Sensor[4B]), RES1 (bidir, see Main[2C], Out[3C]), RES2 (bidir, see Main[2C], Out[3C]), RES3 (bidir, see Main[2C], Out[3C]), RX_D (bidir, see Main[2A], Out[2A]), RX_P (bidir, see Main[2B], Out[2C]), SCL (bidir, see Main[2A], Out[2A], Sensor[1C]), SCLK (bidir, see Main[2B], Out[3B]), SDA (bidir, see Main[2A], Out[2B], Sensor[1C]), SH (out, see Main[1C], Out[3C], Sensor[2A]), SWCLK (bidir, see Main[2B], Out[4B]), SWDIO (bidir, see Main[2B], Out[4B]), SWO (bidir, see Main[2B], Out[4B]), T_ALERT (in, see Main[2C], Sensor[1C]), TX_D (bidir, see Main[2A], Out[2B]), TX_P (bidir, see Main[2B], Out[1C]), WKUP (in, see Main[2B], Out[3C])

### Nets
AGND: C15.1 C22.2 C23.2 U3.12(VSSA/VREF-) U3.20(PA4) U3.22(PA6)
GND: C12.1 C13.1 C14.2 C16.1 C17.2 C18.2 C19.2 C20.2 C21.2 J2.03 J3.03 SW1.1 U3.18(VSS_4) U3.31(VSS_1) U3.47(VSS_2) U3.63(VSS_3)
VDD: C17.1 C18.1 C19.1 C20.1 C21.1 FL1.2 J2.01 J3.01 U3.19(VDD_4) U3.32(VDD_1) U3.48(VDD_2) U3.64(VDD_3)
VDDA: C22.1 C23.1 FL1.1 U3.13(VDDA/VREF+)
BOOT0: J2.02 U3.60(BOOT0)
BOOT1: J3.02 U3.28(PB2)
NetB1_3: U3.17(PA3) ; port ICG
NetB1_4: U3.26(PB0) ; port fM
NetB1_5: U3.15(PA1) ; port SH
NetC12_2: C12.2 U3.5(PH0-OSC_IN) X1.2
NetC13_2: C13.2 U3.6(PH1-OSC_OUT) X1.1
NetC14_1: C14.1 SW1.2 U3.7(NRST) ; port NRST
NetC15_2: C15.2 U3.21(PA5) ; port OS_OA
NetC16_2: C16.2 U3.30(VCAP_1)
NetC32_1: U3.58(PB6) ; port BUTTON
NetJ5_01: U3.38(PC7) ; port RX_D
NetJ5_02: U3.37(PC6) ; port TX_D
NetJ6_01: U3.41(PA8) ; port SCL
NetJ6_02: U3.40(PC9) ; port SDA
NetJ7_02: U3.36(PB15) ; port MOSI
NetJ7_03: U3.35(PB14) ; port MISO
NetJ7_04: U3.34(PB13) ; port SCLK
NetJ7_05: U3.33(PB12) ; port CS1
NetJ7_06: U3.16(PA2) ; port CS2
NetJ8_02: U3.55(PB3) ; port SWO
NetJ8_03: U3.49(PA14) ; port SWCLK
NetJ8_05: U3.46(PA13) ; port SWDIO
NetJ9_02: U3.29(PB10) ; port RES3
NetJ9_03: U3.27(PB1) ; port RES2
NetJ9_04: U3.25(PC5) ; port RES1
NetJ9_05: U3.14(PA0) ; port WKUP
NetJ11_1: U3.61(PB8) ; port A_PELCTRL
NetJ11_2: U3.62(PB9) ; port A_STEP
NetJ11_3: U3.57(PB5) ; port A_NENBL1
NetJ11_4: U3.56(PB4) ; port A_NSLP1
NetJ11_5: U3.54(PD2) ; port A_DIR
NetJ11_6: U3.53(PC12) ; port A_NENBL2
NetJ11_7: U3.52(PC11) ; port A_NSLP2
NetR9_1: U3.10(PC2) ; port T_ALERT
NetR13_1: U3.59(PB7) ; port LED
NetR14_2: U3.43(PA10) ; port RX_P
NetR15_1: U3.42(PA9) ; port TX_P

Not connected (* = marked no-connect by the designer): U3 1(VBAT)* 2(PC13) 3(PC14-OSC32_IN) 4(PC15-OSC32_OUT) 8(PC0) 9(PC1) 11(PC3) 23(PA7) 24(PC4) 39(PC8) 44(PA11) 45(PA12) 50(PA15) 51(PC10)

### Notes on the sheet
- Text
- MICROCONTROLLER
- PORTABLE RAMAN SPECTROMETER
- BOARD-A-UC-01
- 3
- 6
- 1.0
- FRANCISCO SPALTRO
- (in symbol CAP_0805) 0805

### Library data of the parts
C12-C23 = CAP_0805: Generic Capacitor
FL1 = MMZ1608B601CTAH0: as FL2 on sheet Sensor; Copyright: Copyright (C) 2025 Ultra Librarian. All rights reserved.; Manufacturer_Part_Number: MMZ1608B601CTAH0
J2 J3 = PIN_HEADER_3: as J5 on sheet Out; SnapEDA_Link: https://www.snapeda.com/parts/TS-103-T-A/Samtec+Inc./view-part/?ref=snap; Package: None; Value: *; Check_prices: https://www.snapeda.com/parts/TS-103-T-A/Samtec+Inc./view-part/?ref=eda
SW1 = SW-B3U-1000P: as SW2 on sheet Out; Price: None; MP: B3U-1000P; Availability: Unavailable; Value: *; Package: None
U3 = STM32F446RCT6TR: ARM® Cortex®-M4 STM32F4 Microcontroller IC 32-Bit Single-Core 180MHz 256KB (256K x 8) FLASH 64-LQFP (10x10); MF: STMicroelectronics; SnapEDA_Link: https://www.snapeda.com/parts/STM32F446RCT6TR/STMicroelectronics/view-part/?ref=snap; Package: LQFP-64 STMicroelectronics; Value: *; MP: STM32F446RCT6TR; Check_prices: https://www.snapeda.com/parts/STM32F446RCT6TR/STMicroelectronics/view-part/?ref=eda
X1 = CRISTAL-CG04874-8M: 8 MHz ±20ppm Crystal 8pF 500 Ohms 2-SMD, No Lead; MF: NDK America, Inc.; SnapEDA_Link: https://www.snapeda.com/parts/CG04874-8M/NDK+America%252C+Inc./view-part/?ref=snap; Package: SMD-2 NDK America,; Value: *; MP: CG04874-8M; Check_prices: https://www.snapeda.com/parts/CG04874-8M/NDK+America%252C+Inc./view-part/?ref=eda

## Nets that join several sheets
AGND: Sensor (31 pins), Power (R2.1), Microcontroller (6 pins)
GND: Out (24 pins), Sensor (8 pins), Power (17 pins), Microcontroller (16 pins)
VDD: Out (8 pins), Sensor (C31.2 R9.2 U4.8), Power (C5.2 C6.2 R1.2), Microcontroller (12 pins)
VTCD: Sensor (B1.1 C24.2 C25.1 FL2.2), Power (C10.2 C11.2 R3.2)
NetB1_3: Out (J10.02), Sensor (B1.3), Microcontroller (U3.17)
NetB1_4: Out (J10.04), Sensor (B1.4), Microcontroller (U3.26)
NetB1_5: Out (J10.01), Sensor (B1.5), Microcontroller (U3.15)
NetC14_1: Out (J8.04), Microcontroller (C14.1 SW1.2 U3.7)
NetC15_2: Out (J10.03), Sensor (C28.2 R7.2 R24.2), Microcontroller (C15.2 U3.21)
NetC32_1: Out (C32.1 R10.1 SW2.2), Microcontroller (U3.58)
NetJ5_01: Out (J5.01), Microcontroller (U3.38)
NetJ5_02: Out (J5.02), Microcontroller (U3.37)
NetJ6_01: Out (J6.01 R12.1), Sensor (U4.2), Microcontroller (U3.41)
NetJ6_02: Out (J6.02 R11.1), Sensor (U4.1), Microcontroller (U3.40)
NetJ7_02: Out (J7.02), Microcontroller (U3.36)
NetJ7_03: Out (J7.03), Microcontroller (U3.35)
NetJ7_04: Out (J7.04), Microcontroller (U3.34)
NetJ7_05: Out (J7.05), Microcontroller (U3.33)
NetJ7_06: Out (J7.06), Microcontroller (U3.16)
NetJ8_02: Out (J8.02), Microcontroller (U3.55)
NetJ8_03: Out (J8.03), Microcontroller (U3.49)
NetJ8_05: Out (J8.05), Microcontroller (U3.46)
NetJ9_02: Out (J9.02), Microcontroller (U3.29)
NetJ9_03: Out (J9.03), Microcontroller (U3.27)
NetJ9_04: Out (J9.04), Microcontroller (U3.25)
NetJ9_05: Out (J9.05), Microcontroller (U3.14)
NetJ11_1: Out (J11.1), Microcontroller (U3.61)
NetJ11_2: Out (J11.2), Microcontroller (U3.62)
NetJ11_3: Out (J11.3), Microcontroller (U3.57)
NetJ11_4: Out (J11.4), Microcontroller (U3.56)
NetJ11_5: Out (J11.5), Microcontroller (U3.54)
NetJ11_6: Out (J11.6), Microcontroller (U3.53)
NetJ11_7: Out (J11.7), Microcontroller (U3.52)
NetR9_1: Sensor (R9.1 U4.3), Microcontroller (U3.10)
NetR13_1: Out (R13.1), Microcontroller (U3.59)
NetR14_2: Out (R14.2), Microcontroller (U3.43)
NetR15_1: Out (R15.1), Microcontroller (U3.42)